# Altium schematic sheet KorszeRT.SchDoc
size A4
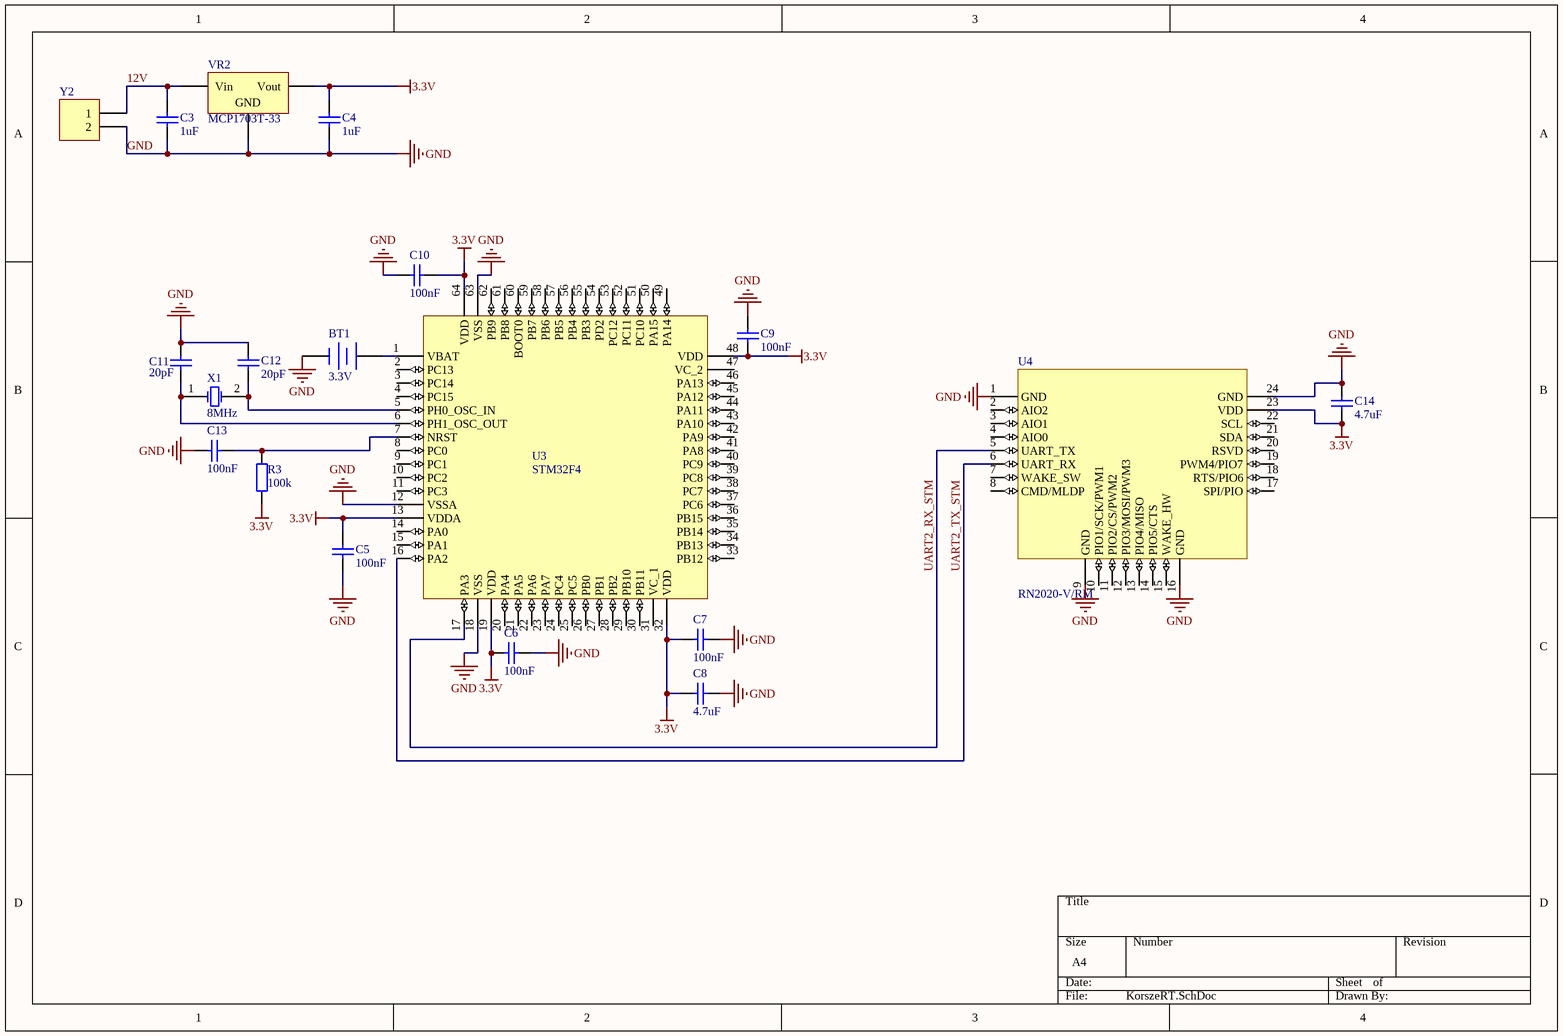
[diagram p0: KorszeRT.SchDoc]

## Parts
BT1  3.3V  [BAT-2]
C3  1uF  [RAD-0.3]
C4  1uF  [RAD-0.3]
C5  100nF  [RAD-0.3]
C6  100nF  [RAD-0.3]
C7  100nF  [RAD-0.3]
C8  4.7uF  [RAD-0.3]
C9  100nF  [RAD-0.3]
C10  100nF  [RAD-0.3]
C11  20pF  [RAD-0.3]
C12  20pF  [RAD-0.3]
C13  100nF  [RAD-0.3]
C14  4.7uF  [RAD-0.3]
R3  100k  [AXIAL-0.4]
U3  STM32F4  [TQFP64_M]
U4  RN2020-V/RM  [RN4020 MODULE-24]
VR2  MCP1703T-33  [SOT23_M]
X1  8MHz  [R38]
Y2  Header 2H  [HDR1X2H]  (value not drawn)

## Nets
3.3V: C4.2 C5.2 C6.2 C7.2 C8.1 C9.1 C10.2 C14.1 R3.2 U3.13(VDDA) U3.19(VDD) U3.32(VDD) U3.48(VDD) U3.64(VDD) U4.23(VDD) VR2.3(Vout)
GND: BT1.2(-) C3.1 C4.1 C5.1 C6.1 C7.1 C8.2 C9.2 C10.1 C11.2 C12.2 C13.2 C14.2 U3.12(VSSA) U3.18(VSS) U3.63(VSS) U4.1(GND) U4.9(GND) U4.16(GND) U4.24(GND) VR2.2(GND) Y2.2
12V: C3.2 VR2.1(Vin) Y2.1
UART2_RX_STM: U3.17(PA3) U4.5(UART_TX)
UART2_TX_STM: U3.16(PA2) U4.6(UART_RX)
NetBT1_1: BT1.1(+) U3.1(VBAT)
NetC11_1: C11.1 U3.6(PH1_OSC_OUT) X1.1(OSC1)
NetC12_1: C12.1 U3.5(PH0_OSC_IN) X1.2(OSC2)
NetC13_1: C13.1 R3.1 U3.7(NRST)

Not connected (* = marked no-connect by the designer): U3 2(PC13) 3(PC14) 4(PC15) 8(PC0) 9(PC1) 10(PC2) 11(PC3) 14(PA0) 15(PA1) 20(PA4) 21(PA5) 22(PA6) 23(PA7) 24(PC4) 25(PC5) 26(PB0) 27(PB1) 28(PB2) 29(PB10) 30(PB11) 31(VC_1) 33(PB12) 34(PB13) 35(PB14) 36(PB15) 37(PC6) 38(PC7) 39(PC8) 40(PC9) 41(PA8) 42(PA9) 43(PA10) 44(PA11) 45(PA12) 46(PA13) 47(VC_2) 49(PA14) 50(PA15) 51(PC10) 52(PC11) 53(PC12) 54(PD2) 55(PB3) 56(PB4) 57(PB5) 58(PB6) 59(PB7) 60(BOOT0) 61(PB8) 62(PB9); U4 2(AIO2) 3(AIO1) 4(AIO0) 7(WAKE_SW) 8(CMD/MLDP) 10(PIO1/SCK/PWM1) 11(PIO2/CS/PWM2) 12(PIO3/MOSI/PWM3) 13(PIO4/MISO) 14(PIO5/CTS) 15(WAKE_HW) 17(SPI/PIO) 18(RTS/PIO6) 19(PWM4/PIO7) 20(RSVD) 21(SDA) 22(SCL)

## Library data of the parts
BT1 = Battery: Multicell Battery; Published: 24-Mar-1999; LatestRevisionDate: 17-Jul-2002; LatestRevisionNote: Re-released for DXP Platform.; PackageReference: BAT-2; Publisher: Altium Limited; PackageDescription: Battery; 2 Leads
C3-C14 = Cap: Capacitor; Published: 8-Jun-2000; LatestRevisionDate: 17-Jul-2002; LatestRevisionNote: Re-released for DXP Platform.; PackageReference: RAD-0.3; Publisher: Altium Limited; PackageDescription: Radial Cap, Thru-Hole; 2 Leads; 0.3 in Pin Spacing
  C3 C4: Value: 1uF
  C5-C7 C9 C10 C13: Value: 100nF
  C8 C14: Value: 4.7uF
  C11 C12: Value: 20pF
R3 = Res2: Resistor; Published: 8-Jun-2000; LatestRevisionDate: 17-Jul-2002; LatestRevisionNote: Re-released for DXP Platform.; PackageReference: AXIAL-0.4; Publisher: Altium Limited; PackageDescription: Axial Device, Thru-Hole; 2 Leads; 0.4 in Pin Spacing; Value: 100k
U3 = STM32F405RGT6
U4 = RN2020-V/RM123: Microchip RN4020 Bluetooth
VR2 = Volt Reg: Voltage Regulator; Published: 24-Mar-1999; LatestRevisionDate: 29-May-2009; LatestRevisionNote: IPC-7351 Footprint Added.; PackageReference: D2PAK; Publisher: Altium Limited; PackageDescription: 3-Pin Transistor Outline Package 2.54 mm Pitch, 15.1 mm Lead Span
X1 = XTAL: Crystal Oscillator; Published: 8-Jun-2000; LatestRevisionDate: 17-Jul-2002; LatestRevisionNote: Re-released for DXP Platform.; PackageReference: R38; Publisher: Altium Limited; PackageDescription: Crystal, Thru-Hole; 2 Leads; Body 3.1 x 8.2 mm (Dia.xH)
Y2 = Header 2H: Header, 2-Pin, Right Angle; LatestRevisionDate: 17-Jul-2002; LatestRevisionNote: Re-released for DXP Platform.; Publisher: Altium Limited